# Altium schematic sheet [ForFun]BalancingRobotonBall_REV1.0.SchDoc
size A
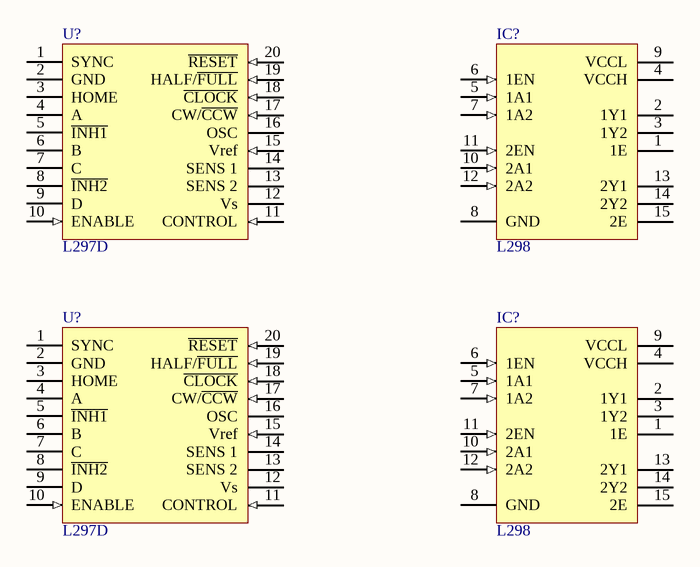
[diagram p0: [ForFun]BalancingRobotonBall_REV1.0.SchDoc]

## Parts
(Parts that share a designator on the sheet are numbered #1, #2 ... from top to bottom, then left to right.)
IC?#1  L298  [DIP15SL2]
IC?#2  L298  [DIP15SL2]
U?#1  L297D  [SO20-300mil]
U?#2  L297D  [SO20-300mil]

## Nets

Not connected (* = marked no-connect by the designer): IC?#1 1(1E) 2(1Y1) 3(1Y2) 4(VCCH) 5(1A1) 6(1EN) 7(1A2) 8(GND) 9(VCCL) 10(2A1) 11(2EN) 12(2A2) 13(2Y1) 14(2Y2) 15(2E); IC?#2 1(1E) 2(1Y1) 3(1Y2) 4(VCCH) 5(1A1) 6(1EN) 7(1A2) 8(GND) 9(VCCL) 10(2A1) 11(2EN) 12(2A2) 13(2Y1) 14(2Y2) 15(2E); U?#1 1(SYNC) 2(GND) 3(HOME) 4(A) 5(~{INH1}) 6(B) 7(C) 8(~{INH2}) 9(D) 10(ENABLE) 11(CONTROL) 12(Vs) 13(SENS_2) 14(SENS_1) 15(Vref) 16(OSC) 17(CW/~{CCW}) 18(~{CLOCK}) 19(HALF/~{FULL}) 20(~{RESET}); U?#2 1(SYNC) 2(GND) 3(HOME) 4(A) 5(~{INH1}) 6(B) 7(C) 8(~{INH2}) 9(D) 10(ENABLE) 11(CONTROL) 12(Vs) 13(SENS_2) 14(SENS_1) 15(Vref) 16(OSC) 17(CW/~{CCW}) 18(~{CLOCK}) 19(HALF/~{FULL}) 20(~{RESET})

## Library data of the parts
IC?#1 IC?#2 = L298: Dual Full-H Driver; Note: The tab is elec is connected to GND pin; Published: 15-May-2002; DatasheetVersion: Jun-1990; PackageReference: KV015; Publisher: Altium Limited; PackageDescription: TO, Thru-Hole, Vertical, Heatsink Mounted; 15 Bent Staggered Leads; Pitch 1.27 mm; ComponentLink1Description: Manufacturer Link; ComponentLink1URL: http://www.ti.com/
U?#1 U?#2 = L297: IC MOTOR CONTROLLER PAR 20SO; Manufacturer: STMicroelectronics; Motor Type - Stepper: Bipolar, Unipolar; Function: Controller - Commutation, Direction Management; Output Configuration: Pre-Driver - Half Bridge (4); Interface: Parallel; Step Resolution: 1, 1/2; Voltage - Supply: 4.75 V ~ 7 V; Supplier 1: Digi-Key; RoHS: RoHS Compliant; Category: Integrated Circuits (ICs); Stock 1: 0; Pricing 1: 200=5.83305 (USD); Packaging: Tube; Motor Type - AC, DC: -; Technology: -; Applications: General Purpose; Current - Output: -; Voltage - Load: -; Operating Temperature: -40°C ~ 150°C (TJ); Mounting Type: Surface Mount; Package / Case: 20-SOIC (0.295", 7.50mm Width); Supplier Device Package: 20-SO; ComponentLink1URL: http://www.st.com/web/en/resource/technical/document/datasheet/CD00000063.pdf; ComponentLink1Description: http://www.st.com/web/en/resource/technical/document/datasheet/CD00000063.pdf; Supplier Part Number 1: 497-3623-5-ND; Manufacturer Part Number: L297D